# Altium schematic sheet MCU3.SchDoc: MCU 3 - STM32G4
size 420 x 297 mm; SheetNumber: 5; SheetTotal: 8
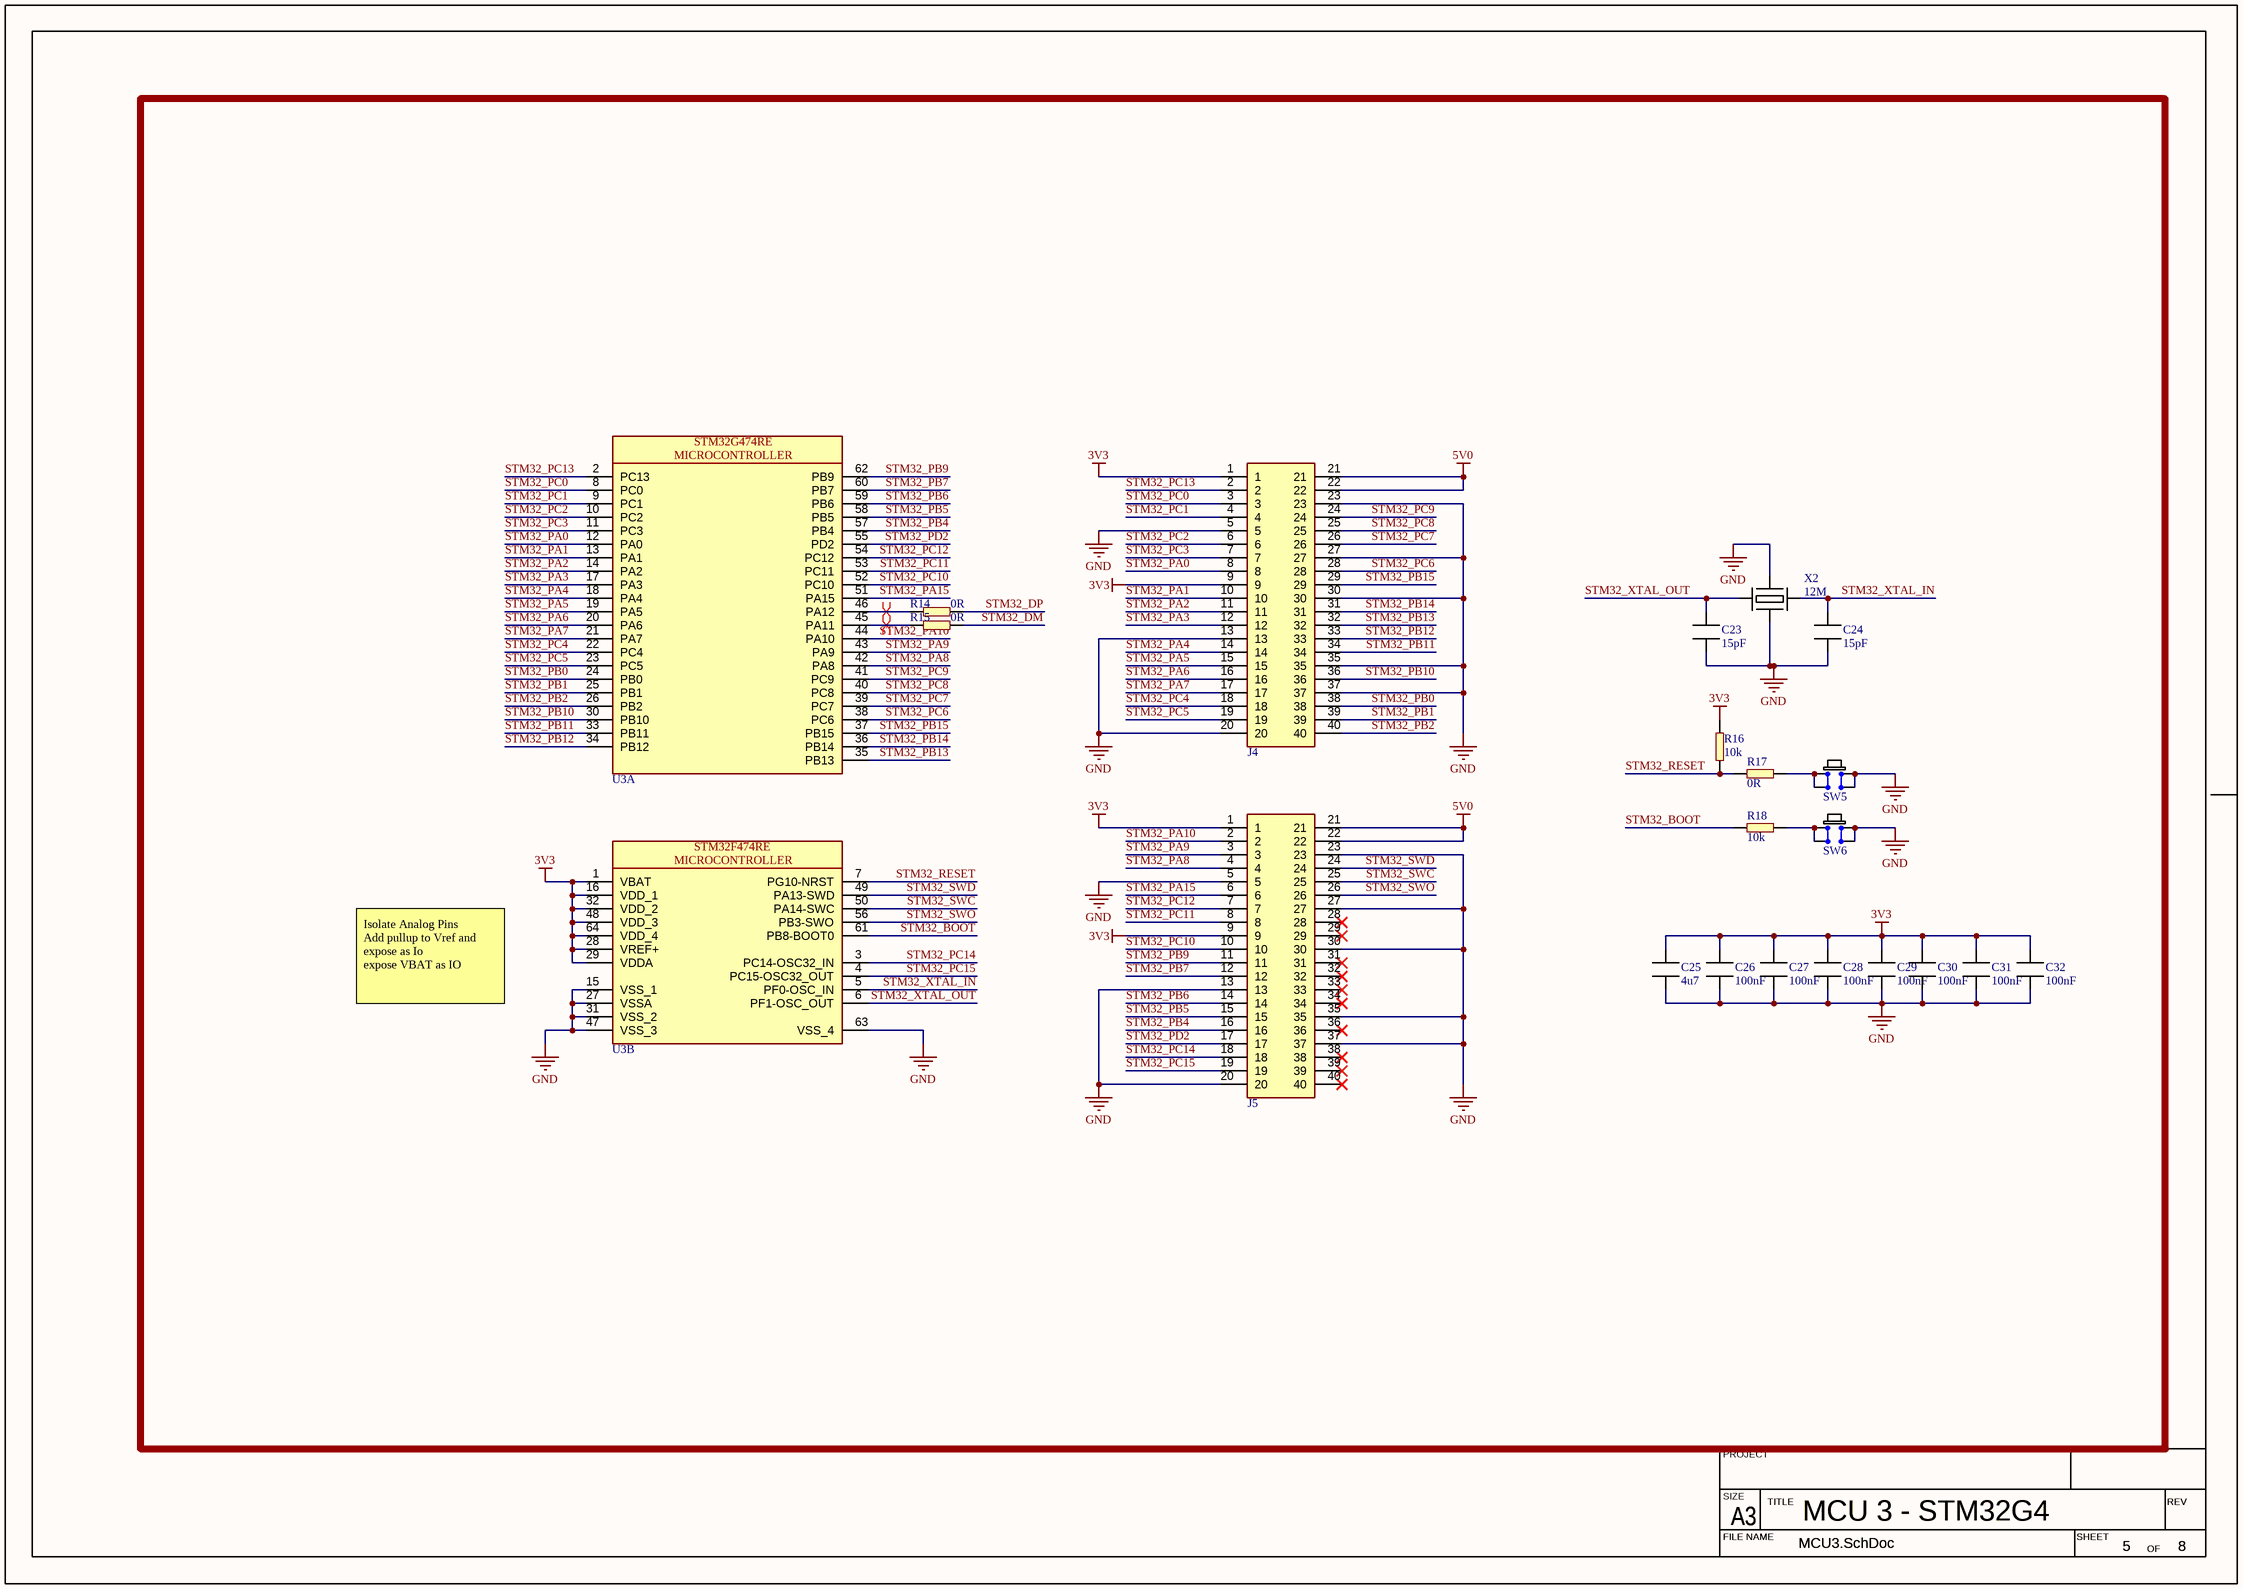
[diagram p0: MCU3.SchDoc]

## Parts
C23  value 15pF  [CAPC2012X13L]  (hidden comment: MLCC_0805)
C24  value 15pF  [CAPC2012X13L]  (hidden comment: MLCC_0805)
C25  value 4u7  [CAPC2012X13L]  (hidden comment: MLCC_0805)
C26  value 100nF  [CAPC2012X13L]  (hidden comment: MLCC_0805)
C27  value 100nF  [CAPC2012X13L]  (hidden comment: MLCC_0805)
C28  value 100nF  [CAPC2012X13L]  (hidden comment: MLCC_0805)
C29  value 100nF  [CAPC2012X13L]  (hidden comment: MLCC_0805)
C30  value 100nF  [CAPC2012X13L]  (hidden comment: MLCC_0805)
C31  value 100nF  [CAPC2012X13L]  (hidden comment: MLCC_0805)
C32  value 100nF  [CAPC2012X13L]  (hidden comment: MLCC_0805)
J4  40PX2R_M_1  [40PX2R_Male_THT]  (value not drawn)
J5  40PX2R_M_1  [40PX2R_Male_THT]  (value not drawn)
R14  value 0R  [RES_0805]  (hidden comment: ERP_101-1)
R15  value 0R  [RES_0805]  (hidden comment: ERP_101-1)
R16  value 10k  [RES_0805]  (hidden comment: ERP_101-1)
R17  value 0R  [RES_0805]  (hidden comment: ERP_101-1)
R18  value 10k  [RES_0805]  (hidden comment: ERP_101-1)
SW5  Generic6X6  [Generic6X6]  (value not drawn)
SW6  Generic6X6  [Generic6X6]  (value not drawn)
U3  STM32G474RE  [TSQFP50P1200X1200X160-64L]  (value not drawn)  (parts A,B of 2)
X2  value 12M  [ABM8]  (hidden comment: ABM8)

## Nets
3V3: C25.1 C26.1 C27.1 C28.1 C29.1 C30.1 C31.1 C32.1 J4.1 J4.9 J5.1 J5.9 R16.1 U3.1(VBAT) U3.16(VDD_1) U3.28(VREF+) U3.29(VDDA) U3.32(VDD_2) U3.48(VDD_3) U3.64(VDD_4)
5V0: J4.21 J4.22 J5.21 J5.22
GND: C23.2 C24.2 C25.2 C26.2 C27.2 C28.2 C29.2 C30.2 C31.2 C32.2 J4.5 J4.13 J4.20 J4.23 J4.27 J4.30 J4.35 J4.37 J5.5 J5.13 J5.20 J5.23 J5.27 J5.30 J5.35 J5.37 SW5.3(COM) SW5.4(COM) SW6.3(COM) SW6.4(COM) U3.15(VSS_1) U3.27(VSSA) U3.31(VSS_2) U3.47(VSS_3) U3.63(VSS_4) X2.2 X2.4
STM32_BOOT: R18.2 U3.61(PB8-BOOT0)
STM32_DM: R15.1
STM32_DP: R14.1
STM32_PA0: J4.8 U3.12(PA0)
STM32_PA1: J4.10 U3.13(PA1)
STM32_PA2: J4.11 U3.14(PA2)
STM32_PA3: J4.12 U3.17(PA3)
STM32_PA4: J4.14 U3.18(PA4)
STM32_PA5: J4.15 U3.19(PA5)
STM32_PA6: J4.16 U3.20(PA6)
STM32_PA7: J4.17 U3.21(PA7)
STM32_PA8: J5.4 U3.42(PA8)
STM32_PA9: J5.3 U3.43(PA9)
STM32_PA10: J5.2 U3.44(PA10)
STM32_PA15: J5.6 U3.51(PA15)
STM32_PB0: J4.38 U3.24(PB0)
STM32_PB1: J4.39 U3.25(PB1)
STM32_PB2: J4.40 U3.26(PB2)
STM32_PB4: J5.16 U3.57(PB4)
STM32_PB5: J5.15 U3.58(PB5)
STM32_PB6: J5.14 U3.59(PB6)
STM32_PB7: J5.12 U3.60(PB7)
STM32_PB9: J5.11 U3.62(PB9)
STM32_PB10: J4.36 U3.30(PB10)
STM32_PB11: J4.34 U3.33(PB11)
STM32_PB12: J4.33 U3.34(PB12)
STM32_PB13: J4.32 U3.35(PB13)
STM32_PB14: J4.31 U3.36(PB14)
STM32_PB15: J4.29 U3.37(PB15)
STM32_PC0: J4.3 U3.8(PC0)
STM32_PC1: J4.4 U3.9(PC1)
STM32_PC2: J4.6 U3.10(PC2)
STM32_PC3: J4.7 U3.11(PC3)
STM32_PC4: J4.18 U3.22(PC4)
STM32_PC5: J4.19 U3.23(PC5)
STM32_PC6: J4.28 U3.38(PC6)
STM32_PC7: J4.26 U3.39(PC7)
STM32_PC8: J4.25 U3.40(PC8)
STM32_PC9: J4.24 U3.41(PC9)
STM32_PC10: J5.10 U3.52(PC10)
STM32_PC11: J5.8 U3.53(PC11)
STM32_PC12: J5.7 U3.54(PC12)
STM32_PC13: J4.2 U3.2(PC13)
STM32_PC14: J5.18 U3.3(PC14-OSC32_IN)
STM32_PC15: J5.19 U3.4(PC15-OSC32_OUT)
STM32_PD2: J5.17 U3.55(PD2)
STM32_RESET: R16.2 R17.2 U3.7(PG10-NRST)
STM32_SWC: J5.25 U3.50(PA14-SWC)
STM32_SWD: J5.24 U3.49(PA13-SWD)
STM32_SWO: J5.26 U3.56(PB3-SWO)
STM32_XTAL_IN: C24.1 U3.5(PF0-OSC_IN) X2.3
STM32_XTAL_OUT: C23.1 U3.6(PF1-OSC_OUT) X2.1
NetR14_2: R14.2 U3.46(PA12)
NetR15_2: R15.2 U3.45(PA11)
NetR17_1: R17.1 SW5.1(NO) SW5.2(NO)
NetR18_1: R18.1 SW6.1(NO) SW6.2(NO)

Not connected (* = marked no-connect by the designer): J5 28* 29* 31* 32* 33* 34* 36* 38* 39* 40*

## Layout directives
differential pair; rule Differential Pairs Routing [Pref Gap = 31.496mil    Min Gap  = 31.496mil    Max Gap  = 31.496milPref Width = 10mil    Min Width  = 10mil    Max Width  = 10mil]: NetR14_2, NetR15_2

## Notes on the sheet
- Isolate Analog Pins
  Add pullup to Vref and expose as Io
  expose VBAT as IO
- PROJECT
- SIZE
- FILE NAME
- A3
- TITLE
- SHEET
- OF
- REV
- (in symbol STM32G474RE, part A) MICROCONTROLLER
- (in symbol STM32G474RE, part B) STM32F474RE; MICROCONTROLLER

## Library data of the parts
C23-C32 = MLCC_0805: Chip Capacitor, 2-Leads, Body 2.00x1.25mm, IPC High Density; Package: 0805; Manufacturer 1: *; Manufacturer Part Number 1: *
J4 J5 = 40PX2R_M_1: Berg Connector Header Through Hole  40 Position 0.100" (2.54mm); Manufacturer 1: CNC Tech; Value: *; Manufacturer Part Number 1: *
R14-R18 = RES_0805: Package: 0805; Manufacturer 1: *; Manufacturer Part Number 1: *
SW5 SW6 = Generic6X6: Tactile Switch SPST-NO Top Actuated Surface Mount; Manufacturer 1: C&K; Manufacturer Part Number 1: *; Package: 4.5X4.5
U3 = STM32G474RE: 512KB 1.71V~3.6V ARM-M4 128KB 170MHz FLASH 52 LQFP-64(10x10) Microcontrollers (MCU/MPU/SOC) ROHS; Manufacturer 1: STMicroelectronics; Manufacturer Part Number 1: STM32G474RET6; Value: *; Package: LQFP-64(10x10)
X2 = ABM8: CRYS_L3.2_W2.5; Manufacturer Part Number 1: ABM8-272-T3; Manufacturer 1: Abracon LLC